# Altium schematic sheet NET&232&USART&SD&FLASH.SchDoc
size A3; SheetNumber: 6; SheetTotal: 6
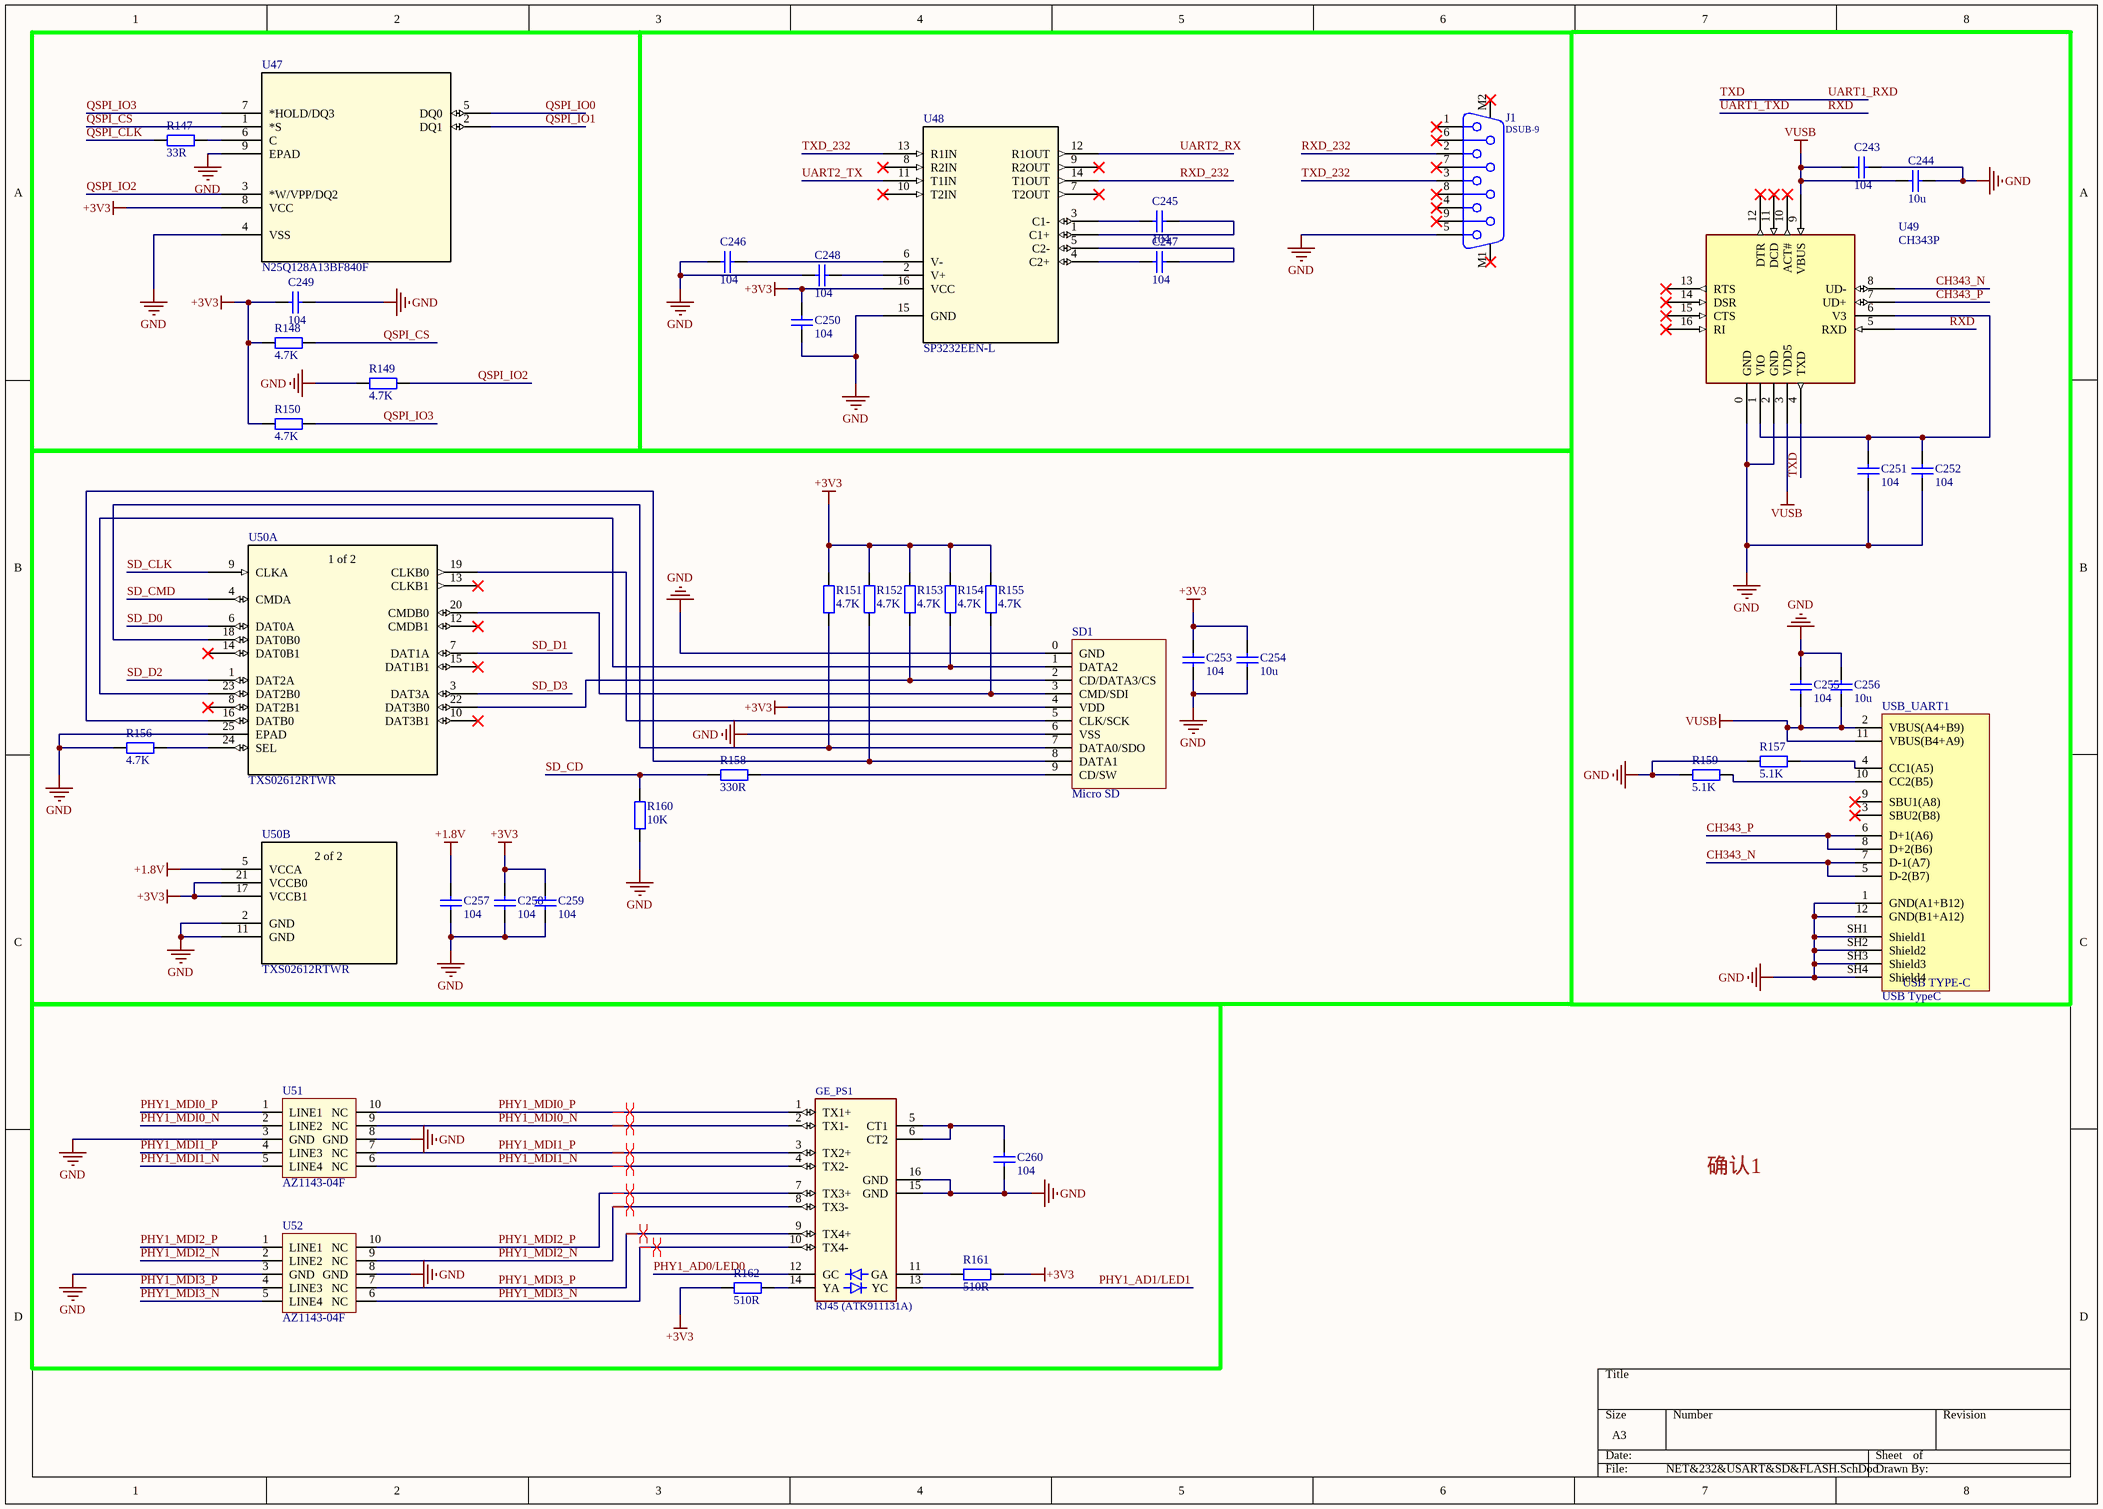
[diagram p0: NET&232&USART&SD&FLASH.SchDoc]

## Parts
C243  104  [C0402_L]
C244  10u  [C0402_L]
C245  104  [C0402_L]
C246  104  [C0402_L]
C247  104  [C0402_L]
C248  104  [C0402_L]
C249  104  [C0402_L]
C250  104  [C0402_L]
C251  104  [C0402_L]
C252  104  [C0402_L]
C253  104  [C0402_L]
C254  10u  [C0402_L]
C255  104  [C0402_L]
C256  10u  [C0402_L]
C257  104  [C0402_L]
C258  104  [C0402_L]
C259  104  [C0402_L]
C260  104  [C0402_L]
GE_PS1  RJ45 (ATK911131A)  [HR911131A]
J1  DSUB-9  [DB-9-H]
R147  33R  [R0402_L]
R148  4.7K  [R0402_L]
R149  4.7K  [R0402_L]
R150  4.7K  [R0402_L]
R151  4.7K  [R0402_L]
R152  4.7K  [R0402_L]
R153  4.7K  [R0402_L]
R154  4.7K  [R0402_L]
R155  4.7K  [R0402_L]
R156  4.7K  [R0402_L]
R157  5.1K  [R0402_L]
R158  330R  [R0402_L]
R159  5.1K  [R0402_L]
R160  10K  [R0402_L]
R161  510R  [R0402_L]
R162  510R  [R0402_L]
SD1  Micro SD  [Micro SD]
U47  N25Q128A13BF840F  [VDFPN8_8X6_MRN]
U48  SP3232EEN-L  [NSOIC-16_MXL]
U49  CH343P  [QFN16_3X3]
U50  TXS02612RTWR  [RTW24_2P45X2P45]  (parts A,B of 2)
U51  AZ1143-04F  [DFN2510P10E]
U52  AZ1143-04F  [DFN2510P10E]
USB_UART1  USB TypeC  [USB Type-C]

## Nets
+1.8V: C257.1 U50.5(VCCA)
+3V3: C249.2 C250.1 C253.1 C254.1 C258.1 C259.1 R148.2 R150.2 R151.1 R152.1 R153.1 R154.1 R155.1 R161.2 R162.1 SD1.4(VDD) U47.8(VCC) U48.16(VCC) U50.17(VCCB1) U50.21(VCCB0)
GND: C243.2 C244.2 C246.2 C248.2 C249.1 C250.2 C251.1 C252.1 C253.2 C254.2 C255.2 C256.2 C257.2 C258.2 C259.2 C260.2 GE_PS1.15(GND) GE_PS1.16(GND) J1.5 R149.2 R156.2 R157.1 R159.1 R160.2 SD1.0(GND) SD1.6(VSS) U47.4(VSS) U47.9(EPAD) U48.15(GND) U49.0(GND) U49.2(GND) U50.2(GND) U50.11(GND) U50.25(EPAD) U51.3(GND) U51.8(GND) U52.3(GND) U52.8(GND) USB_UART1.1(GND(A1+B12)) USB_UART1.12(GND(B1+A12)) USB_UART1.SH1(Shield1) USB_UART1.SH2(Shield2) USB_UART1.SH3(Shield3) USB_UART1.SH4(Shield4)
VUSB: C243.1 C244.1 C255.1 C256.1 U49.3(VDD5) U49.9(VBUS) USB_UART1.2(VBUS(A4+B9)) USB_UART1.11(VBUS(B4+A9))
CH343_N: U49.8(UD-) USB_UART1.5(D-2(B7)) USB_UART1.7(D-1(A7))
CH343_P: U49.7(UD+) USB_UART1.6(D+1(A6)) USB_UART1.8(D+2(B6))
PHY1_AD0/LED0: GE_PS1.12(GC)
PHY1_AD1/LED1: GE_PS1.13(YC)
PHY1_MDI0_N: GE_PS1.2(TX1-) U51.2(LINE2) U51.9(NC)
PHY1_MDI0_P: GE_PS1.1(TX1+) U51.1(LINE1) U51.10(NC)
PHY1_MDI1_N: GE_PS1.4(TX2-) U51.5(LINE4) U51.6(NC)
PHY1_MDI1_P: GE_PS1.3(TX2+) U51.4(LINE3) U51.7(NC)
PHY1_MDI2_N: GE_PS1.8(TX3-) U52.2(LINE2) U52.9(NC)
PHY1_MDI2_P: GE_PS1.7(TX3+) U52.1(LINE1) U52.10(NC)
PHY1_MDI3_N: GE_PS1.10(TX4-) U52.5(LINE4) U52.6(NC)
PHY1_MDI3_P: GE_PS1.9(TX4+) U52.4(LINE3) U52.7(NC)
QSPI_CLK: R147.2
QSPI_CS: R148.1 U47.1(*S)
QSPI_IO0: U47.5(DQ0)
QSPI_IO1: U47.2(DQ1)
QSPI_IO2: R149.1 U47.3(*W/VPP/DQ2)
QSPI_IO3: R150.1 U47.7(*HOLD/DQ3)
RXD: U49.5(RXD)  [also labelled UART1_TXD]
RXD_232: J1.2 U48.14(T1OUT)
SD_CD: R158.2 R160.1
SD_CLK: U50.9(CLKA)
SD_CMD: U50.4(CMDA)
SD_D0: U50.6(DAT0A)
SD_D1: U50.7(DAT1A)
SD_D2: U50.1(DAT2A)
SD_D3: U50.3(DAT3A)
TXD: U49.4(TXD)  [also labelled UART1_RXD]
TXD_232: J1.3 U48.13(R1IN)
UART2_RX: U48.12(R1OUT)
UART2_TX: U48.11(T1IN)
NetC245_1: C245.1 U48.1(C1+)
NetC245_2: C245.2 U48.3(C1-)
NetC246_1: C246.1 U48.6(V-)
NetC247_1: C247.1 U48.5(C2-)
NetC247_2: C247.2 U48.4(C2+)
NetC248_1: C248.1 U48.2(V+)
NetC251_2: C251.2 C252.2 U49.1(VIO) U49.6(V3)
NetC260_1: C260.1 GE_PS1.5(CT1) GE_PS1.6(CT2)
NetGE_PS1_11: GE_PS1.11(GA) R161.1
NetGE_PS1_14: GE_PS1.14(YA) R162.2
NetR147_1: R147.1 U47.6(C)
NetR151_2: R151.2 SD1.7(DATA0/SDO) U50.18(DAT0B0)
NetR152_2: R152.2 SD1.8(DATA1) U50.16(DATB0)
NetR153_2: R153.2 SD1.2(CD/DATA3/CS) U50.22(DAT3B0)
NetR154_2: R154.2 SD1.1(DATA2) U50.23(DAT2B0)
NetR155_2: R155.2 SD1.3(CMD/SDI) U50.20(CMDB0)
NetR156_1: R156.1 U50.24(SEL)
NetR157_2: R157.2 USB_UART1.4(CC1(A5))
NetR158_1: R158.1 SD1.9(CD/SW)
NetR159_2: R159.2 USB_UART1.10(CC2(B5))
NetSD1_5: SD1.5(CLK/SCK) U50.19(CLKB0)

Not connected (* = marked no-connect by the designer): J1 1* 4* 6* 7* 8* 9* M1* M2*; U48 7(T2OUT)* 8(R2IN)* 9(R2OUT)* 10(T2IN)*; U49 10(ACT#)* 11(DCD)* 12(DTR)* 13(RTS)* 14(DSR)* 15(CTS)* 16(RI)*; U50 8(DAT2B1)* 10(DAT3B1)* 12(CMDB1)* 13(CLKB1)* 14(DAT0B1)* 15(DAT1B1)*; USB_UART1 3(SBU2(B8))* 9(SBU1(A8))*

## Layout directives
differential pair: PHY1_MDI0_N, PHY1_MDI0_P, PHY1_MDI1_N, PHY1_MDI1_P, PHY1_MDI2_N, PHY1_MDI2_P, PHY1_MDI3_N, PHY1_MDI3_P

## Notes on the sheet
- 确认1
- (in symbol TXS02612RTWR, part A) 1 of 2
- (in symbol TXS02612RTWR, part B) 2 of 2
- (in symbol USB Type-C) USB TYPE-C

## Library data of the parts
C243-C260 = C: 贴片电容/MLCC电容; BOM名称: 无极性贴片电容; 当前库版本V2023.5.31 @淘宝卖家:黄晶宝石: 最新版本发布https://item.taobao.com/item.htm?id=566775463719
GE_PS1 = HR911131A/C_1: 千兆以太网接口
J1 = DSUB-9: DSUB-9Pin母座; 当前库版本V2023.5.31 @淘宝卖家:黄晶宝石: 最新版本发布https://shop463601444.taobao.com
R147-R162 = R: 贴片电阻; 联系下单店铺卖家 免费帮你查找封装: 联系下单店铺卖家 免费技术支持; BOM名称: 贴片电阻
SD1 = Micro SD: Micro SD卡; 版权归属: 源创客; BOM名称: Micro SD卡; 学习资源: www.ooocke.com
U47 = N25Q128A13BF840F: No Description Available; Mfr_Name: Micron; RefDes: RefDes; Type: Type
U48 = SP3232EEN-L: No Description Available; Mfr_Name: MaxLinear; RefDes: RefDes; Type: Type
U49 = CH343P: USB to high speed enhanced TTL Serial / UART
U50 = TXS02612RTWR: No Description Available; Mfr_Name: Texas Instruments; RefDes: RefDes; Type: Type
U51 U52 = AZ1143-04F: ESD保护二极管阵列
USB_UART1 = USB Type-C: 12P TypeC 母座